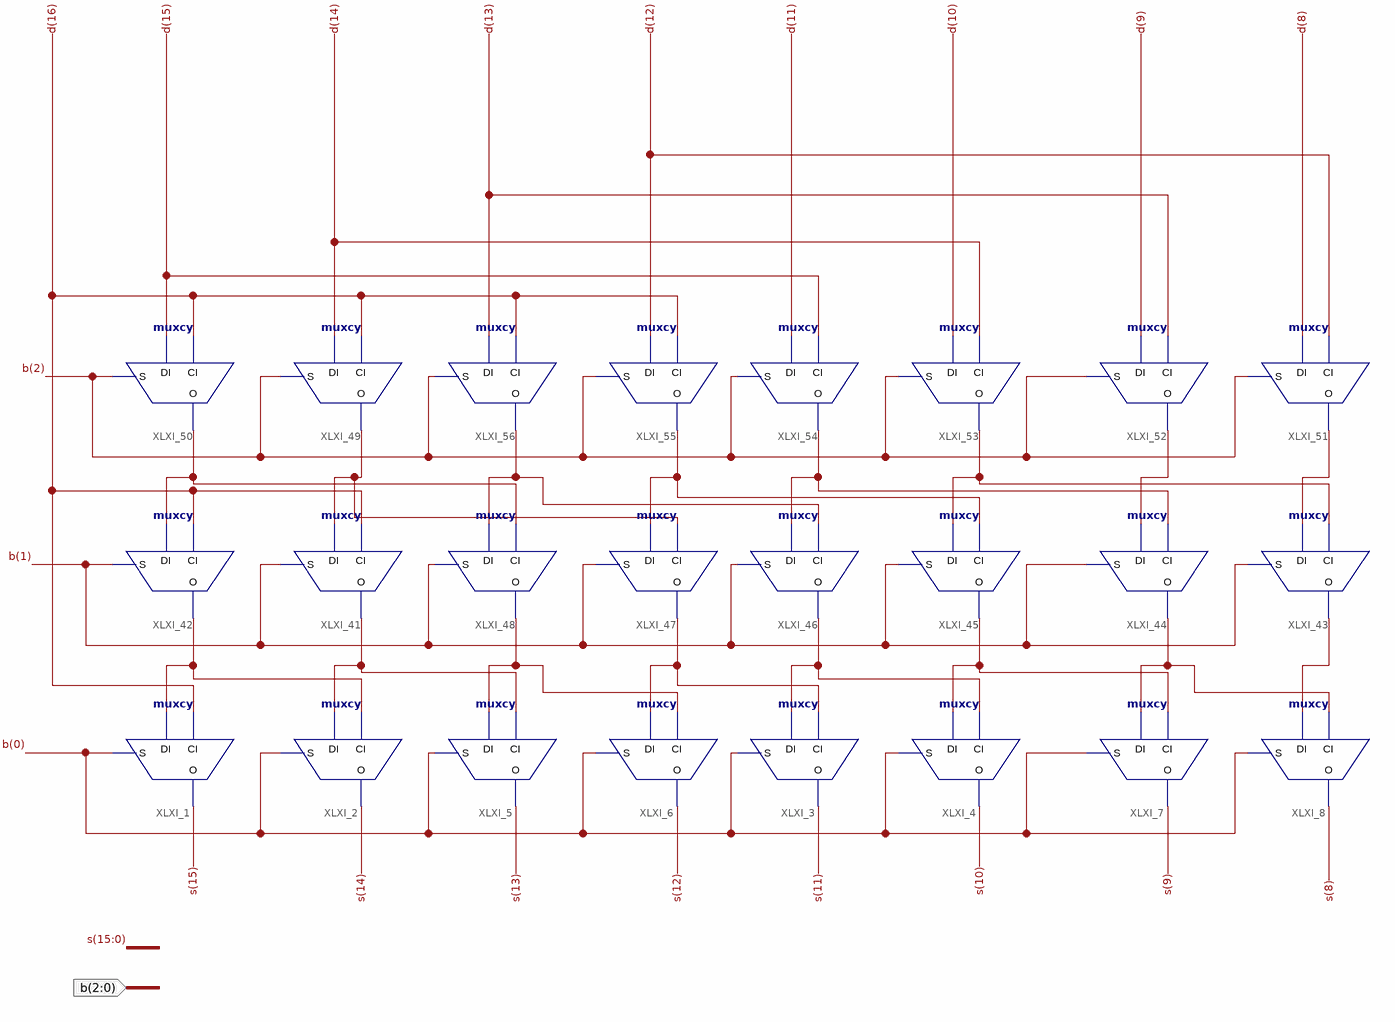
[diagram p0: schematic sheet 1]
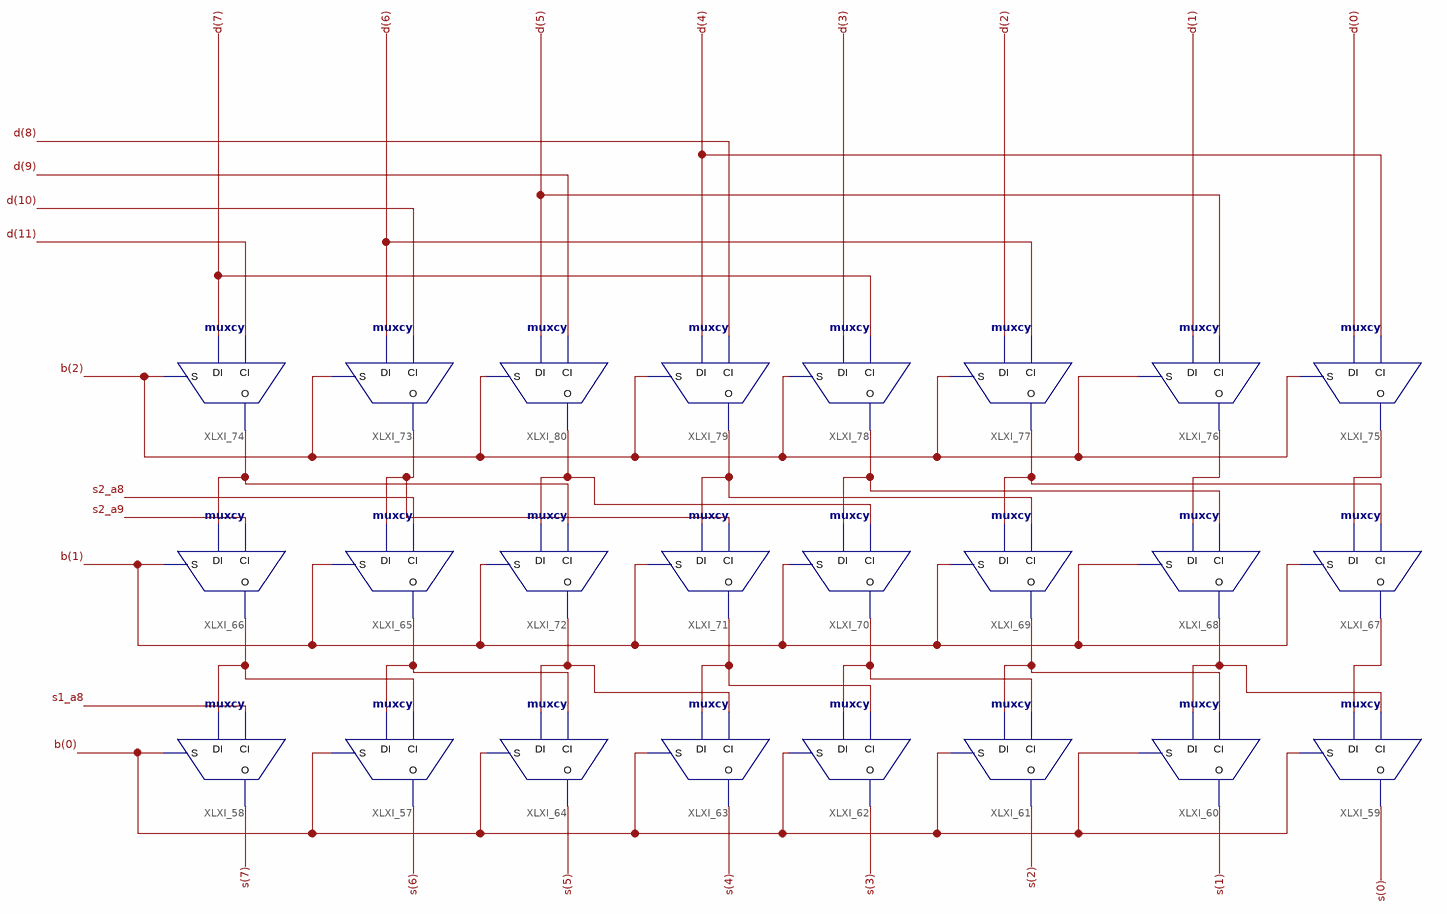
[diagram p1: schematic sheet 2]
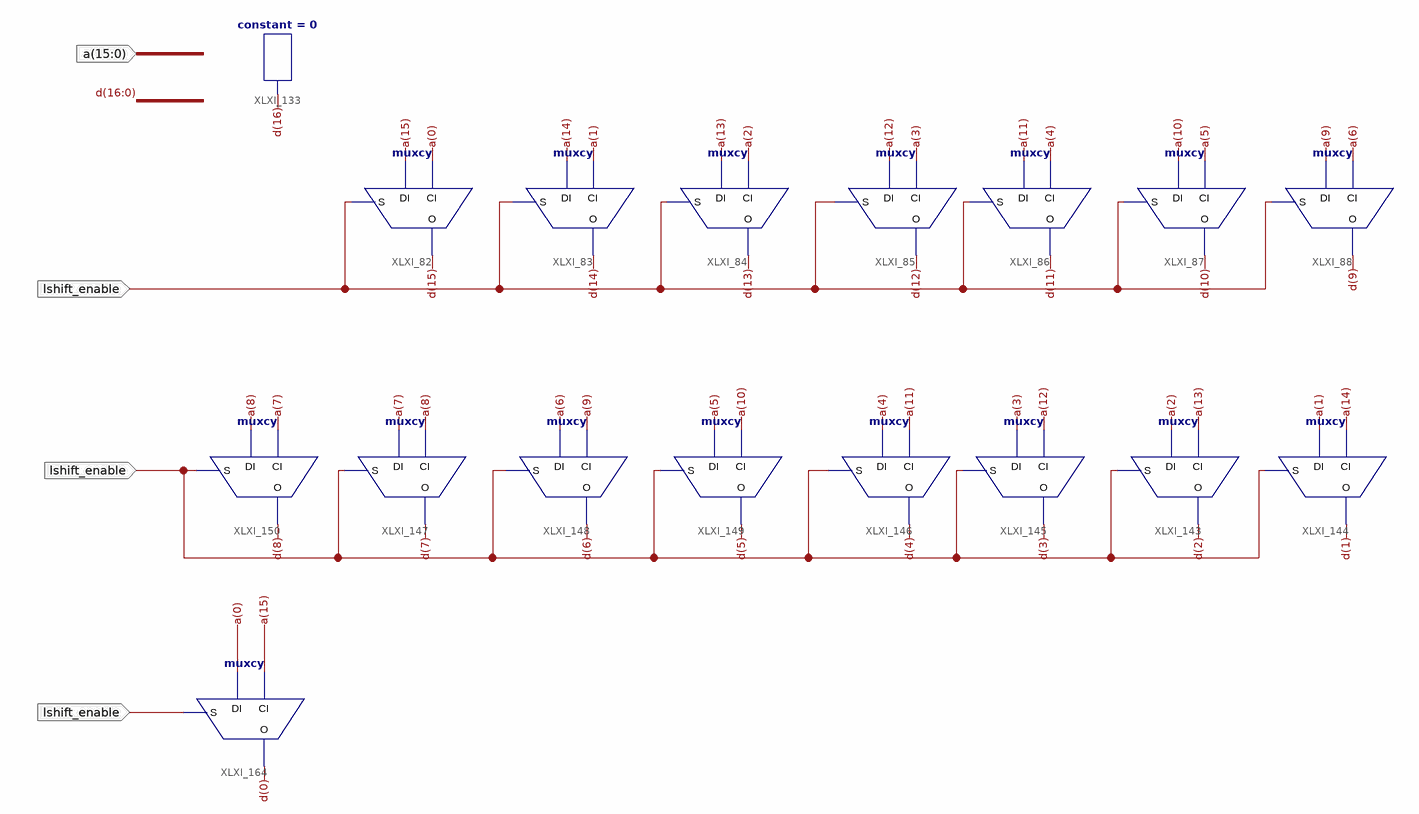
[diagram p2: schematic sheet 3]
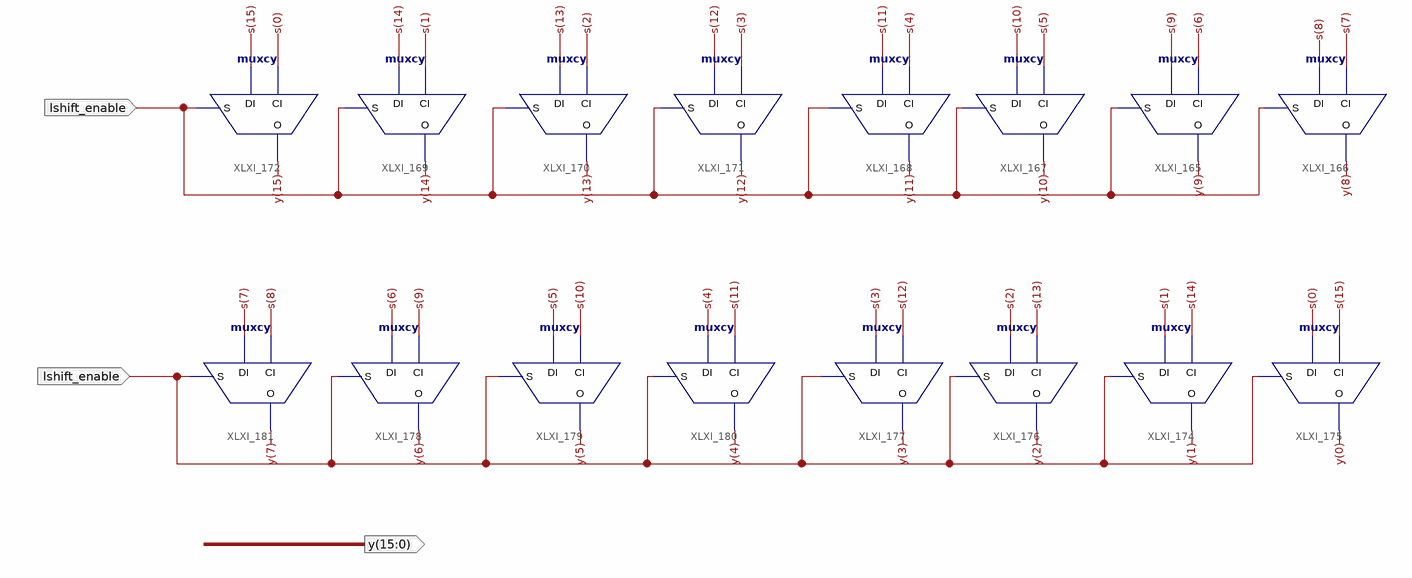
[diagram p3: schematic sheet 4]
// Xilinx ISE schematic barrel_shift.sch (spartan3e) as structural Verilog: 81 symbols, 4 ports
module barrel_shift (
  input  lshift_enable,
  input  [15:0] a,
  input  [2:0] b,
  output [15:0] y
);

  wire s1_a8, s2_a8, s2_a9, XLXN_29, XLXN_30, XLXN_31, XLXN_32, XLXN_33, XLXN_34, XLXN_38, XLXN_39, XLXN_40,
       XLXN_41, XLXN_42, XLXN_43, XLXN_44, XLXN_57, XLXN_58, XLXN_59, XLXN_60, XLXN_61, XLXN_62, XLXN_63,
       XLXN_64, XLXN_65, XLXN_66, XLXN_67, XLXN_68, XLXN_69, XLXN_70, XLXN_71, XLXN_72;
  wire [15:0] s;
  wire [16:0] d;

  muxcy XLXI_2 (.CI(XLXN_38), .DI(XLXN_39), .S(b[0]), .O(s[14]));
  muxcy XLXI_1 (.CI(d[16]), .DI(XLXN_38), .S(b[0]), .O(s[15]));
  muxcy XLXI_8 (.CI(XLXN_44), .DI(s1_a8), .S(b[0]), .O(s[8]));
  muxcy XLXI_7 (.CI(XLXN_43), .DI(XLXN_44), .S(b[0]), .O(s[9]));
  muxcy XLXI_4 (.CI(XLXN_42), .DI(XLXN_43), .S(b[0]), .O(s[10]));
  muxcy XLXI_3 (.CI(XLXN_41), .DI(XLXN_42), .S(b[0]), .O(s[11]));
  muxcy XLXI_6 (.CI(XLXN_40), .DI(XLXN_41), .S(b[0]), .O(s[12]));
  muxcy XLXI_5 (.CI(XLXN_39), .DI(XLXN_40), .S(b[0]), .O(s[13]));
  muxcy XLXI_41 (.CI(d[16]), .DI(XLXN_30), .S(b[1]), .O(XLXN_39));
  muxcy XLXI_42 (.CI(d[16]), .DI(XLXN_29), .S(b[1]), .O(XLXN_38));
  muxcy XLXI_43 (.CI(XLXN_34), .DI(s2_a8), .S(b[1]), .O(s1_a8));
  muxcy XLXI_44 (.CI(XLXN_33), .DI(s2_a9), .S(b[1]), .O(XLXN_44));
  muxcy XLXI_45 (.CI(XLXN_32), .DI(XLXN_34), .S(b[1]), .O(XLXN_43));
  muxcy XLXI_46 (.CI(XLXN_31), .DI(XLXN_33), .S(b[1]), .O(XLXN_42));
  muxcy XLXI_47 (.CI(XLXN_30), .DI(XLXN_32), .S(b[1]), .O(XLXN_41));
  muxcy XLXI_48 (.CI(XLXN_29), .DI(XLXN_31), .S(b[1]), .O(XLXN_40));
  muxcy XLXI_49 (.CI(d[16]), .DI(d[14]), .S(b[2]), .O(XLXN_30));
  muxcy XLXI_50 (.CI(d[16]), .DI(d[15]), .S(b[2]), .O(XLXN_29));
  muxcy XLXI_51 (.CI(d[12]), .DI(d[8]), .S(b[2]), .O(s2_a8));
  muxcy XLXI_52 (.CI(d[13]), .DI(d[9]), .S(b[2]), .O(s2_a9));
  muxcy XLXI_53 (.CI(d[14]), .DI(d[10]), .S(b[2]), .O(XLXN_34));
  muxcy XLXI_54 (.CI(d[15]), .DI(d[11]), .S(b[2]), .O(XLXN_33));
  muxcy XLXI_55 (.CI(d[16]), .DI(d[12]), .S(b[2]), .O(XLXN_32));
  muxcy XLXI_56 (.CI(d[16]), .DI(d[13]), .S(b[2]), .O(XLXN_31));
  muxcy XLXI_57 (.CI(XLXN_65), .DI(XLXN_66), .S(b[0]), .O(s[6]));
  muxcy XLXI_58 (.CI(s1_a8), .DI(XLXN_65), .S(b[0]), .O(s[7]));
  muxcy XLXI_59 (.CI(XLXN_71), .DI(XLXN_72), .S(b[0]), .O(s[0]));
  muxcy XLXI_60 (.CI(XLXN_70), .DI(XLXN_71), .S(b[0]), .O(s[1]));
  muxcy XLXI_61 (.CI(XLXN_69), .DI(XLXN_70), .S(b[0]), .O(s[2]));
  muxcy XLXI_62 (.CI(XLXN_68), .DI(XLXN_69), .S(b[0]), .O(s[3]));
  muxcy XLXI_63 (.CI(XLXN_67), .DI(XLXN_68), .S(b[0]), .O(s[4]));
  muxcy XLXI_64 (.CI(XLXN_66), .DI(XLXN_67), .S(b[0]), .O(s[5]));
  muxcy XLXI_65 (.CI(s2_a8), .DI(XLXN_57), .S(b[1]), .O(XLXN_66));
  muxcy XLXI_66 (.CI(s2_a9), .DI(XLXN_64), .S(b[1]), .O(XLXN_65));
  muxcy XLXI_67 (.CI(XLXN_61), .DI(XLXN_63), .S(b[1]), .O(XLXN_72));
  muxcy XLXI_68 (.CI(XLXN_60), .DI(XLXN_62), .S(b[1]), .O(XLXN_71));
  muxcy XLXI_69 (.CI(XLXN_59), .DI(XLXN_61), .S(b[1]), .O(XLXN_70));
  muxcy XLXI_70 (.CI(XLXN_58), .DI(XLXN_60), .S(b[1]), .O(XLXN_69));
  muxcy XLXI_71 (.CI(XLXN_57), .DI(XLXN_59), .S(b[1]), .O(XLXN_68));
  muxcy XLXI_72 (.CI(XLXN_64), .DI(XLXN_58), .S(b[1]), .O(XLXN_67));
  muxcy XLXI_73 (.CI(d[10]), .DI(d[6]), .S(b[2]), .O(XLXN_57));
  muxcy XLXI_74 (.CI(d[11]), .DI(d[7]), .S(b[2]), .O(XLXN_64));
  muxcy XLXI_75 (.CI(d[4]), .DI(d[0]), .S(b[2]), .O(XLXN_63));
  muxcy XLXI_76 (.CI(d[5]), .DI(d[1]), .S(b[2]), .O(XLXN_62));
  muxcy XLXI_77 (.CI(d[6]), .DI(d[2]), .S(b[2]), .O(XLXN_61));
  muxcy XLXI_78 (.CI(d[7]), .DI(d[3]), .S(b[2]), .O(XLXN_60));
  muxcy XLXI_79 (.CI(d[8]), .DI(d[4]), .S(b[2]), .O(XLXN_59));
  muxcy XLXI_80 (.CI(d[9]), .DI(d[5]), .S(b[2]), .O(XLXN_58));
  muxcy XLXI_87 (.CI(a[5]), .DI(a[10]), .S(lshift_enable), .O(d[10]));
  muxcy XLXI_88 (.CI(a[6]), .DI(a[9]), .S(lshift_enable), .O(d[9]));
  muxcy XLXI_86 (.CI(a[4]), .DI(a[11]), .S(lshift_enable), .O(d[11]));
  muxcy XLXI_85 (.CI(a[3]), .DI(a[12]), .S(lshift_enable), .O(d[12]));
  muxcy XLXI_82 (.CI(a[0]), .DI(a[15]), .S(lshift_enable), .O(d[15]));
  muxcy XLXI_83 (.CI(a[1]), .DI(a[14]), .S(lshift_enable), .O(d[14]));
  muxcy XLXI_84 (.CI(a[2]), .DI(a[13]), .S(lshift_enable), .O(d[13]));
  muxcy XLXI_143 (.CI(a[13]), .DI(a[2]), .S(lshift_enable), .O(d[2]));
  muxcy XLXI_144 (.CI(a[14]), .DI(a[1]), .S(lshift_enable), .O(d[1]));
  muxcy XLXI_145 (.CI(a[12]), .DI(a[3]), .S(lshift_enable), .O(d[3]));
  muxcy XLXI_146 (.CI(a[11]), .DI(a[4]), .S(lshift_enable), .O(d[4]));
  muxcy XLXI_147 (.CI(a[8]), .DI(a[7]), .S(lshift_enable), .O(d[7]));
  muxcy XLXI_148 (.CI(a[9]), .DI(a[6]), .S(lshift_enable), .O(d[6]));
  muxcy XLXI_149 (.CI(a[10]), .DI(a[5]), .S(lshift_enable), .O(d[5]));
  muxcy XLXI_150 (.CI(a[7]), .DI(a[8]), .S(lshift_enable), .O(d[8]));
  muxcy XLXI_164 (.CI(a[15]), .DI(a[0]), .S(lshift_enable), .O(d[0]));
  muxcy XLXI_165 (.CI(s[6]), .DI(s[9]), .S(lshift_enable), .O(y[9]));
  muxcy XLXI_167 (.CI(s[5]), .DI(s[10]), .S(lshift_enable), .O(y[10]));
  muxcy XLXI_168 (.CI(s[4]), .DI(s[11]), .S(lshift_enable), .O(y[11]));
  muxcy XLXI_169 (.CI(s[1]), .DI(s[14]), .S(lshift_enable), .O(y[14]));
  muxcy XLXI_170 (.CI(s[2]), .DI(s[13]), .S(lshift_enable), .O(y[13]));
  muxcy XLXI_171 (.CI(s[3]), .DI(s[12]), .S(lshift_enable), .O(y[12]));
  muxcy XLXI_172 (.CI(s[0]), .DI(s[15]), .S(lshift_enable), .O(y[15]));
  muxcy XLXI_174 (.CI(s[14]), .DI(s[1]), .S(lshift_enable), .O(y[1]));
  muxcy XLXI_175 (.CI(s[15]), .DI(s[0]), .S(lshift_enable), .O(y[0]));
  muxcy XLXI_176 (.CI(s[13]), .DI(s[2]), .S(lshift_enable), .O(y[2]));
  muxcy XLXI_177 (.CI(s[12]), .DI(s[3]), .S(lshift_enable), .O(y[3]));
  muxcy XLXI_178 (.CI(s[9]), .DI(s[6]), .S(lshift_enable), .O(y[6]));
  muxcy XLXI_179 (.CI(s[10]), .DI(s[5]), .S(lshift_enable), .O(y[5]));
  muxcy XLXI_180 (.CI(s[11]), .DI(s[4]), .S(lshift_enable), .O(y[4]));
  muxcy XLXI_181 (.CI(s[8]), .DI(s[7]), .S(lshift_enable), .O(y[7]));
  muxcy XLXI_166 (.CI(s[7]), .DI(s[8]), .S(lshift_enable), .O(y[8]));
  constant #(.CValue("0")) XLXI_133 (.O(d[16]));
endmodule
